# EAGLE design ForceAssistHandBrd (EAGLE 9.4.2)
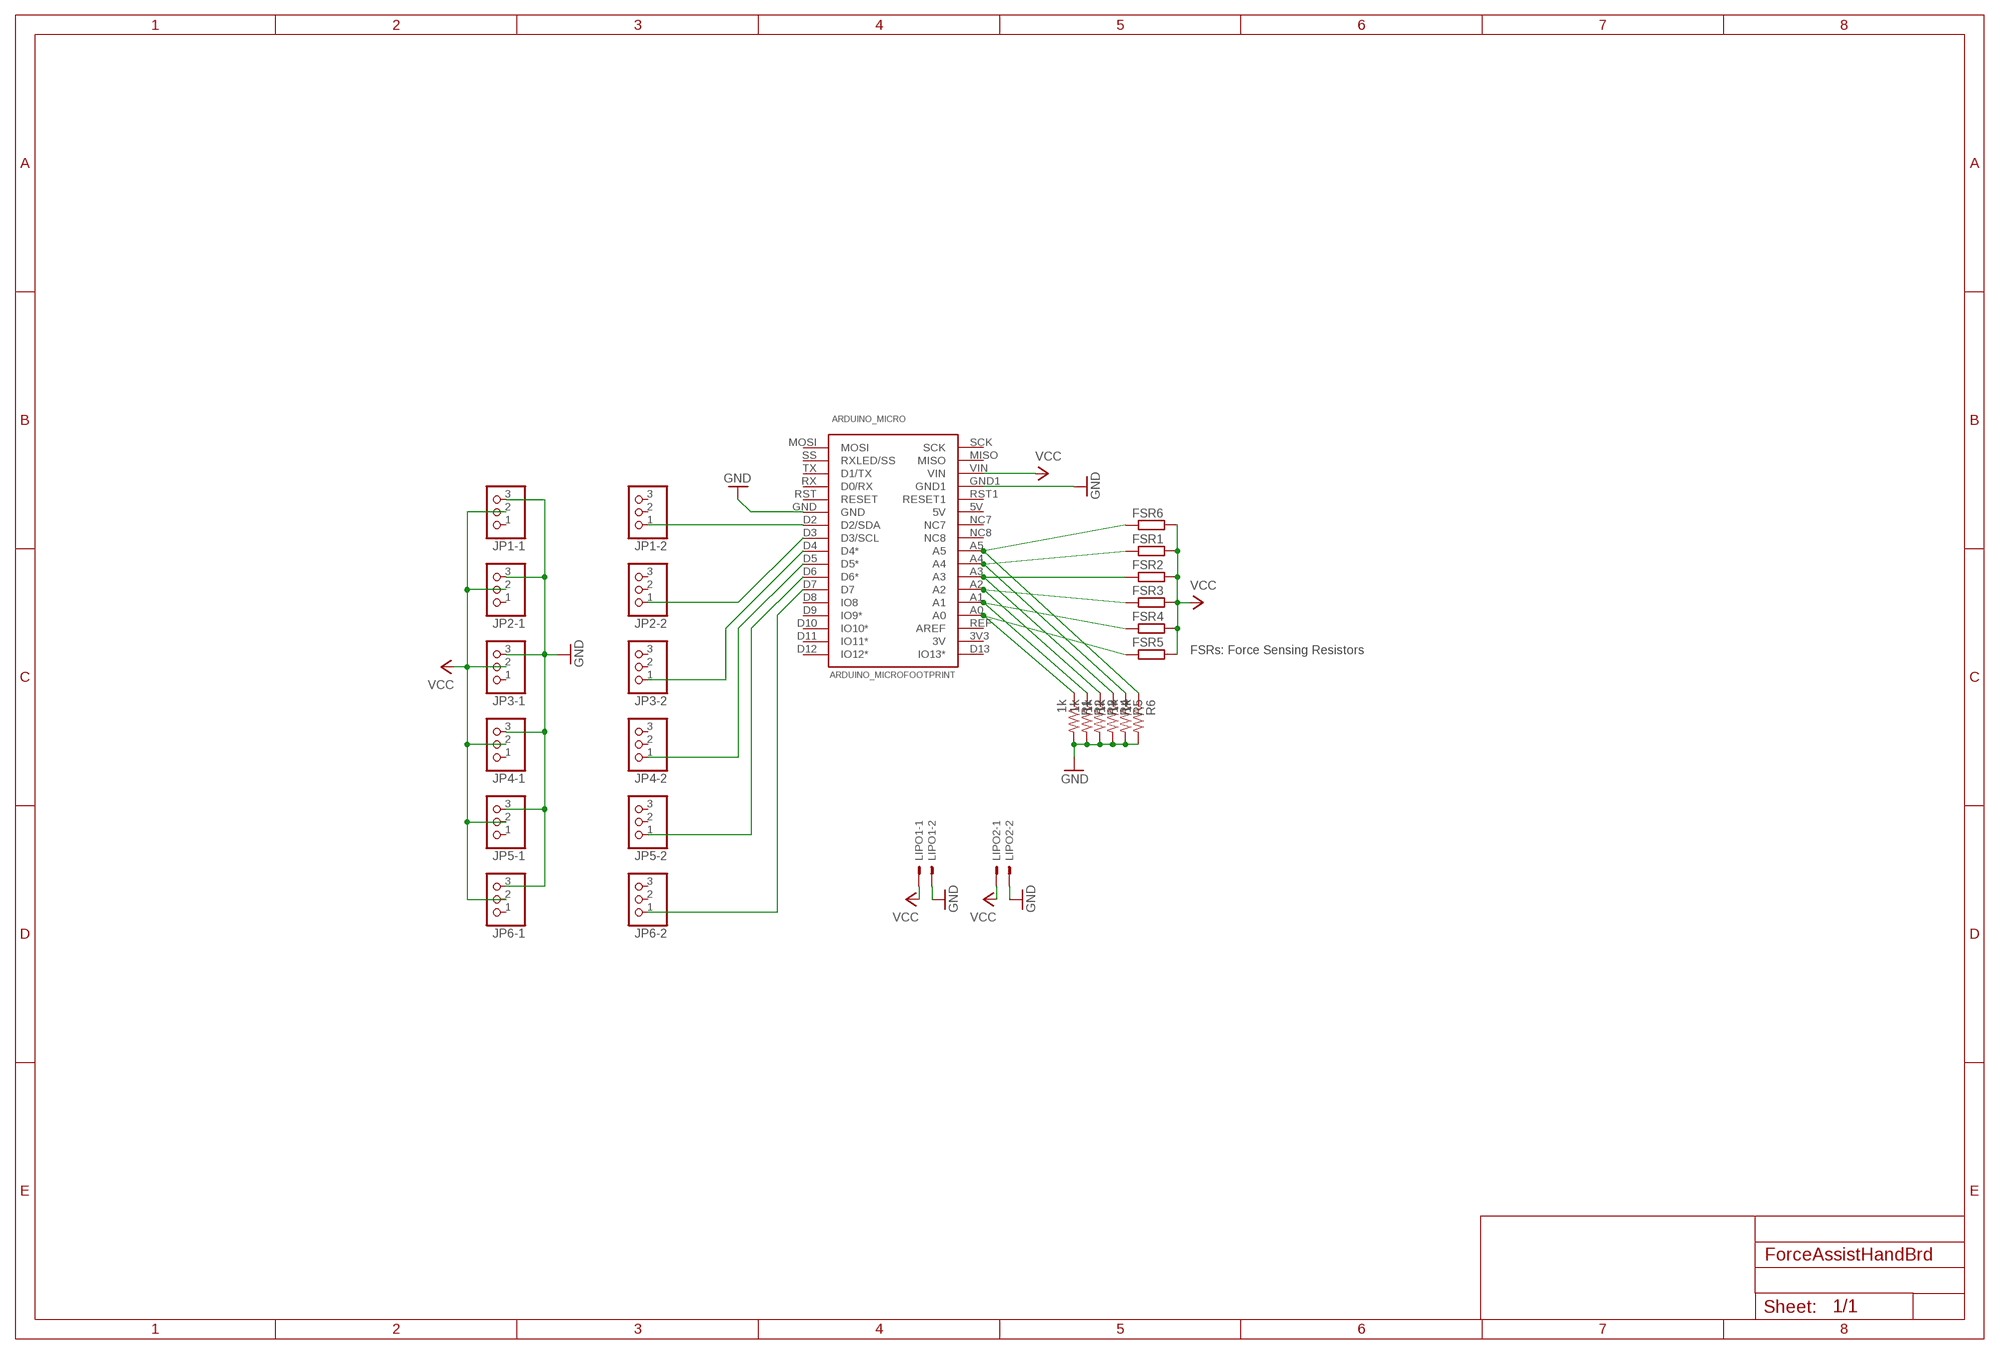
[diagram p0: schematic, sheet 1]

## Parts
ARDUINO_MICRO  ARDUINO_MICROFOOTPRINT  [ARDUINO-MICRO]
FSR1  R-EU_0204/2V  [0204V]
FSR2  R-EU_0204/2V  [0204V]
FSR3  R-EU_0204/2V  [0204V]
FSR4  R-EU_0204/2V  [0204V]
FSR5  R-EU_0204/2V  [0204V]
FSR6  R-EU_0204/2V  [0204V]
JP1-1  PINHD-1X3  [1X03]
JP1-2  PINHD-1X3  [1X03]
JP2-1  PINHD-1X3  [1X03]
JP2-2  PINHD-1X3  [1X03]
JP3-1  PINHD-1X3  [1X03]
JP3-2  PINHD-1X3  [1X03]
JP4-1  PINHD-1X3  [1X03]
JP4-2  PINHD-1X3  [1X03]
JP5-1  PINHD-1X3  [1X03]
JP5-2  PINHD-1X3  [1X03]
JP6-1  PINHD-1X3  [1X03]
JP6-2  PINHD-1X3  [1X03]
LIPO1  22-23-2021  [22-23-2021]
LIPO2  22-23-2021  [22-23-2021]
R1  1k  R-US_0204/7  [0204/7]
R2  1k  R-US_0204/7  [0204/7]
R3  1k  R-US_0204/7  [0204/7]
R4  1k  R-US_0204/7  [0204/7]
R5  1k  R-US_0204/7  [0204/7]
R6  1k  R-US_0204/7  [0204/7]

## Nets
GND: ARDUINO_MICRO.GND ARDUINO_MICRO.GND1 JP1-1.3 JP2-1.3 JP3-1.3 JP4-1.3 JP5-1.3 JP6-1.3 LIPO1.2 LIPO2.2 R1.2 R2.2 R3.2 R4.2 R5.2 R6.2
N$1: ARDUINO_MICRO.D2(D2/SDA) JP1-2.1
N$2: ARDUINO_MICRO.D3(D3/SCL) JP2-2.1
N$3: ARDUINO_MICRO.D4(D4*) JP3-2.1
N$4: ARDUINO_MICRO.D5(D5*) JP4-2.1
N$5: ARDUINO_MICRO.D6(D6*) JP5-2.1
N$6: ARDUINO_MICRO.A5 FSR6.1 R6.1
N$7: ARDUINO_MICRO.A3 FSR2.1 R4.1
N$8: ARDUINO_MICRO.A4 FSR1.1 R5.1
N$9: ARDUINO_MICRO.A2 FSR3.1 R3.1
N$10: ARDUINO_MICRO.A1 FSR4.1 R2.1
N$11: ARDUINO_MICRO.A0 FSR5.1 R1.1
N$13: ARDUINO_MICRO.D7 JP6-2.1
VCC [VCC]: ARDUINO_MICRO.VIN FSR1.2 FSR2.2 FSR3.2 FSR4.2 FSR5.2 FSR6.2 JP1-1.2 JP2-1.2 JP3-1.2 JP4-1.2 JP5-1.2 JP6-1.2 LIPO1.1 LIPO2.1
Unconnected: ARDUINO_MICRO.3V3(3V) ARDUINO_MICRO.5V ARDUINO_MICRO.D8(IO8) ARDUINO_MICRO.D9(IO9*) ARDUINO_MICRO.D10(IO10*) ARDUINO_MICRO.D11(IO11*) ARDUINO_MICRO.D12(IO12*) ARDUINO_MICRO.D13(IO13*) ARDUINO_MICRO.MISO ARDUINO_MICRO.MOSI ARDUINO_MICRO.NC7 ARDUINO_MICRO.NC8 ARDUINO_MICRO.REF(AREF) ARDUINO_MICRO.RST1(RESET1) ARDUINO_MICRO.RST(RESET) ARDUINO_MICRO.RX(D0/RX) ARDUINO_MICRO.SCK ARDUINO_MICRO.SS(RXLED/SS) ARDUINO_MICRO.TX(D1/TX) JP1-1.1 JP1-2.2 JP1-2.3 JP2-1.1 JP2-2.2 JP2-2.3 JP3-1.1 JP3-2.2 JP3-2.3 JP4-1.1 JP4-2.2 JP4-2.3 JP5-1.1 JP5-2.2 JP5-2.3 JP6-1.1 JP6-2.2 JP6-2.3

## Notes on the sheet
- FSRs: Force Sensing Resistors

## Library data of the parts
ARDUINO_MICRO = arduino-micro:ARDUINO_MICRO
FSR1-FSR6 = resistor:R-EU_: RESISTOR, European symbol
JP1-1 JP1-2 JP2-1 JP2-2 JP3-1 JP3-2 JP4-1 JP4-2 JP5-1 JP5-2 JP6-1 JP6-2 = pinhead:PINHD-1X3: PIN HEADER
LIPO1 LIPO2 = con-molex:22-23-2021: .100" (2.54mm) Center Header - 2 Pin; MF: MOLEX; MPN: 22-23-2021; OC_FARNELL: 1462926; OC_NEWARK: 25C3832
R1-R6 = adafruit:R-US_: RESISTOR, American symbol

## Net classes
0 default: width 0.254 mm, clearance 0.203 mm
1 PWR: width 0.508 mm, clearance 0.203 mm
2 VCC: width 1.016 mm, clearance 0.381 mm

## Board
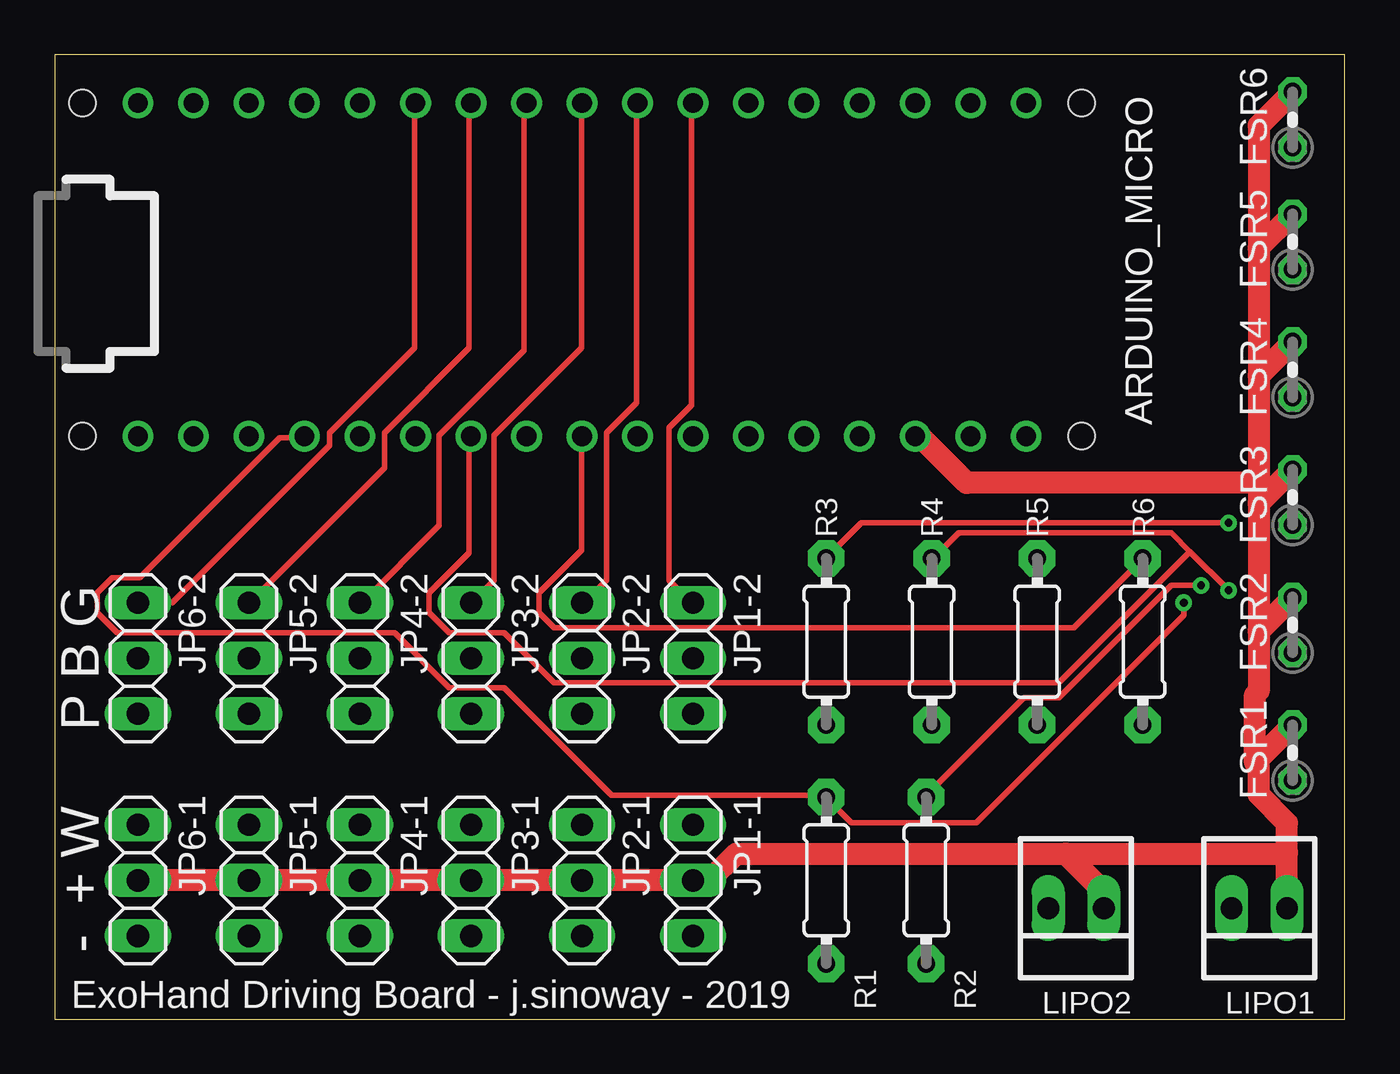
[diagram p1: board, top side]
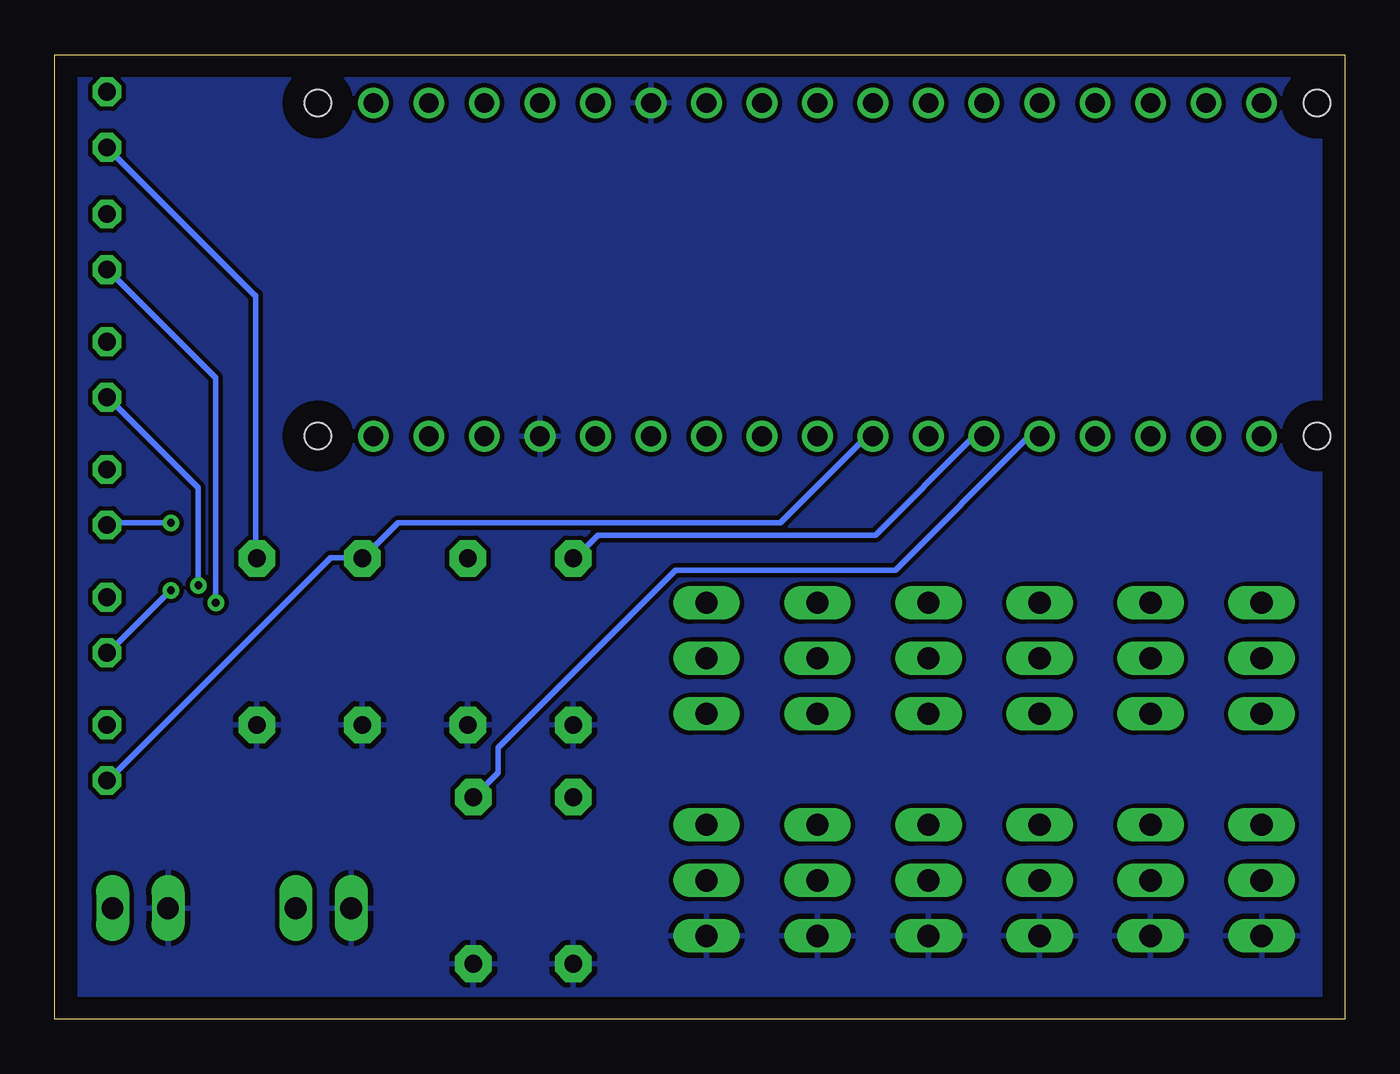
[diagram p2: board, bottom side, seen from below]

Size 59.03 x 44.12 mm. Coordinates in mm from the lower left corner, seen from the top.
Outline: 0,0 59.03,0 59.03,44.12 0,44.12 0,0
Copper layers (1*16): Top 0.035mm / dielectric 1.5mm / Bottom 0.035mm
Design rules "default": minimum track width 6mil, minimum drill 0.35mm, track to track 6mil, track to pad 6mil, pad to pad 6mil, via to via 6mil, smd to smd 6mil, copper to edge 40mil, drill to drill 6mil, minimum pad ring 10mil, minimum via ring 8mil, stop-mask expansion 4mil, vias tented up to drill 0mil, thermal gap 10mil

### Footprints (pad centres in the part's own frame; a part is rotated, then mirrored left to right if it is on the bottom)
ARDUINO-MICRO = drill 0.9: 3V3 16.51,3.81; 5V 16.51,29.21; A0 16.51,8.89; A1 16.51,11.43; A2 16.51,13.97; A3 16.51,16.51; A4 16.51,19.05; A5 16.51,21.59; D2 1.27,26.67; D3 1.27,24.13; D4 1.27,21.59; D5 1.27,19.05; D6 1.27,16.51; D7 1.27,13.97; D8 1.27,11.43; D9 1.27,8.89; D10 1.27,6.35; D11 1.27,3.81; D12 1.27,1.27; D13 16.51,1.27; GND 1.27,29.21; GND1 16.51,34.29; MISO 16.51,39.37; MOSI 1.27,41.91; NC7 16.51,26.67; NC8 16.51,24.13; REF 16.51,6.35; RST 1.27,31.75; RST1 16.51,31.75; RX 1.27,34.29; SCK 16.51,41.91; SS 1.27,39.37; TX 1.27,36.83; VIN 16.51,36.83 | hole 1.2: 1.27,-1.27; 16.51,-1.27; 1.27,44.45; 16.51,44.45
0204V = drill 0.813 octagon: 1 -1.27,0; 2 1.27,0
1X03 = drill 1.016 long: 1 -2.54,0; 2 0,0; 3 2.54,0
22-23-2021 = drill 1 long: 1 -1.27,0; 2 1.27,0
0204/7 = drill 0.813 pad 1.676 octagon: 1 -3.81,0; 2 3.81,0

### Placement (x,y rotation side)
ARDUINO_MICRO  2.54,43.18 270 top
FSR1  56.64,12.19 90 top
FSR2  56.64,18.03 90 top
FSR3  56.64,23.88 90 top
FSR4  56.64,29.72 90 top
FSR5  56.64,35.56 90 top
FSR6  56.64,41.15 90 top
JP1-1  29.21,6.35 270 top
JP1-2  29.21,16.51 270 top
JP2-1  24.13,6.35 270 top
JP2-2  24.13,16.51 270 top
JP3-1  19.05,6.35 270 top
JP3-2  19.05,16.51 270 top
JP4-1  13.97,6.35 270 top
JP4-2  13.97,16.51 270 top
JP5-1  8.89,6.35 270 top
JP5-2  8.89,16.51 270 top
JP6-1  3.81,6.35 270 top
JP6-2  3.81,16.51 270 top
LIPO1  55.12,5.08 180 top
LIPO2  46.74,5.08 180 top
R1  35.31,6.35 270 top
R2  39.88,6.35 270 top
R3  35.31,17.27 270 top
R4  40.13,17.27 270 top
R5  44.96,17.27 270 top
R6  49.78,17.27 270 top

### Tracks (layer width: path | path; a pad name or v marks a point on that pad's centre or on a via)
GND
  pour Bottom: 0,0 58.42,0 58.42,44.04 0,44.04
N$1
  Top 0.254: ARDUINO_MICRO.D2 29.15,41.91 29.15,28.08 28.12,27.05 28.12,20.08 29.15,19.05 JP1-2.1
N$2
  Top 0.254: ARDUINO_MICRO.D3 26.63,41.91 26.63,28.19 25.26,26.82 25.26,20.08 24.23,19.05 JP2-2.1
N$3
  Top 0.254: ARDUINO_MICRO.D4 24.12,41.91 24.12,30.71 20.12,26.71 20.12,20.08 19.09,19.05 JP3-2.1
N$4
  Top 0.254: ARDUINO_MICRO.D5 21.49,41.91 21.49,30.59 17.6,26.71 17.6,22.59 14.06,19.05 JP4-2.1
N$5
  Top 0.254: ARDUINO_MICRO.D6 18.97,41.91 18.97,30.71 15.09,26.82 15.09,25.22 8.91,19.05 JP5-2.1
N$6
  Top 0.254: ARDUINO_MICRO.A5 24.12,26.59 24.12,21.45 22.17,19.51 22.17,18.59 22.86,17.91 46.63,17.91 49.72,20.99 R6.1
  Bottom 0.254: R6.1 49.84,21.11 49.84,33.11 49.87,33.11 FSR6.1
N$7  (via drill 0.35)
  Top 0.254: 51.95,21.39 51.09,22.25 41.38,22.25 40.23,21.11 R4.1 | 51.95,21.39 v53.72,19.62 | 51.95,21.39 45.95,15.39 22.86,15.39 20.57,17.68 18.06,17.68 17.14,18.59 17.14,19.51 18.97,21.34 18.97,26.59 ARDUINO_MICRO.A3
  Bottom 0.254: v53.72,19.62 56.58,16.76 FSR2.1
N$8
  Bottom 0.254: FSR1.1 56.58,10.93 46.41,21.11 45.03,21.11 R5.1 44.92,21.11 43.32,22.71 25.83,22.71 21.95,26.59 21.6,26.59 ARDUINO_MICRO.A4
N$9  (via drill 0.35)
  Top 0.254: v53.72,22.71 36.92,22.71 35.32,21.11 R3.1
  Bottom 0.254: v53.72,22.71 56.58,22.71 FSR3.1 | ARDUINO_MICRO.A2 16.57,26.59 17.03,26.59 21.49,22.14 34.18,22.14 35.2,21.11 R3.1
N$10  (via drill 0.35)
  Top 0.254: v52.46,19.85 51.09,19.85 45.95,14.71 44.35,14.71 39.89,10.25 R2.1
  Bottom 0.254: v52.46,19.85 52.46,24.31 56.58,28.42 FSR4.1 | ARDUINO_MICRO.A1 14.06,26.59 14.52,26.59 20.57,20.54 30.63,20.54 38.75,12.42 38.75,11.28 39.78,10.25 R2.1
N$11  (via drill 0.35)
  Top 0.254: v51.66,19.05 51.66,18.48 42.18,8.99 36.46,8.99 35.32,10.13 R1.1 35.2,10.25 25.49,10.25 20.57,15.16 18.06,15.16 15.54,17.68 2.86,17.68 1.94,18.59 1.94,19.51 2.63,20.19 3.89,20.19 10.29,26.59 11.43,26.59 ARDUINO_MICRO.A0
  Bottom 0.254: v51.66,19.05 51.66,29.34 56.58,34.25 FSR5.1
N$13
  Top 0.254: JP6-2.1 5.37,19.05 12.57,26.25 12.57,26.82 16.46,30.71 16.46,41.91 ARDUINO_MICRO.D7
VCC
  Top 1.016: JP2-1.2 JP1-1.2 29.97,6.35 31.2,7.58 46.26,7.58 | JP2-1.2 24.12,6.35 | 24.12,6.35 19.09,6.35 | 19.09,6.35 JP3-1.2 | JP3-1.2 JP4-1.2 | JP4-1.2 13.95,6.35 | 13.95,6.35 JP5-1.2 JP6-1.2 | FSR1.2 54.91,11.73 | LIPO2.1 48.01,5.83 46.26,7.58 | FSR2.2 55.09,17.75 | 55.09,17.75 55.09,15.01 54.91,14.83 54.91,11.73 | FSR3.2 55.09,23.6 | FSR4.2 55.09,29.44 | FSR5.2 55.09,35.28 | 55.09,35.28 55.09,40.87 FSR6.2 | 55.09,35.28 55.09,29.44 | 55.09,29.44 55.09,24.54 | 55.09,24.54 55.09,23.6 | 55.09,23.6 55.09,17.75 | 54.91,11.73 55.09,11.56 55.09,10.28 56.39,8.98 56.39,7.62 | LIPO1.1 56.39,7.62 | 46.26,7.58 56.35,7.58 56.39,7.62 | 55.09,24.54 41.72,24.54 39.66,26.59 39.43,26.59 ARDUINO_MICRO.VIN | JP4-1.2 13.95,6.36 13.95,6.35 | JP3-1.2 19.09,6.36 19.09,6.35 | JP2-1.2 24.12,6.36 24.12,6.35

### Text on the board
tPlace: P B G | - + W | ExoHand Driving Board - j.sinoway - 2019